# Altium project MiCore.PrjPCB
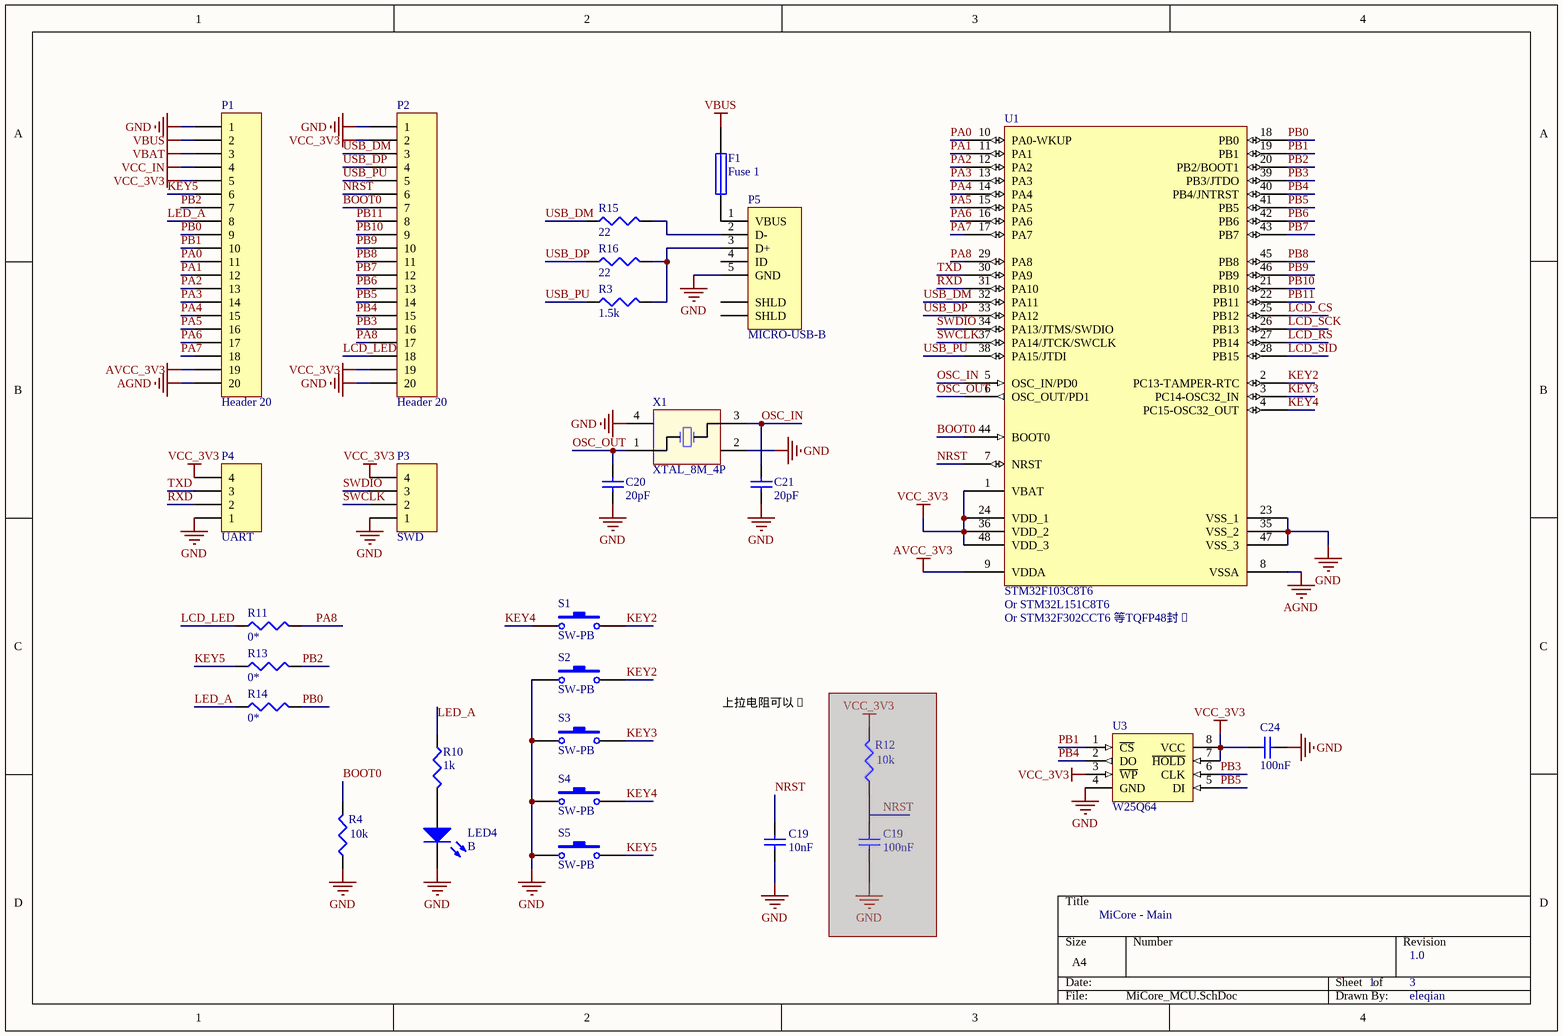
[diagram p0: MiCore_MCU.SchDoc]
3 sheets, 63 parts. Net scope: global (net labels, ports and power ports of the same name join across sheets).
Board file: MiCore.PcbDoc
Sheets:
  MiCore_MCU.SchDoc
  MiCore_PWR.SchDoc
  MiCore_LCD.SchDoc

## Sheet MiCore_MCU.SchDoc: MiCore - Main
size A4; DrawnBy: eleqian; Revision: 1.0; SheetNumber: 1; SheetTotal: 3

### Parts
(Parts that share a designator on the sheet are numbered #1, #2 ... from top to bottom, then left to right.)
C19#1  value 10nF  [0603C]  (hidden comment: Cap)
C19#2  value 100nF  [0603C]  (hidden comment: Cap)  (masked out: inside a compile mask, not in the netlist)
C20  value 20pF  [0603C]  (hidden comment: Cap)
C21  value 20pF  [0603C]  (hidden comment: Cap)
C24  value 100nF  [0603C]  (hidden comment: Cap)
F1  Fuse 1  [0805F]
LED4  B  [0603LED]
P1  Header 20  [HDR1X20]
P2  Header 20  [HDR1X20]
P3  SWD  [HDR1X4]
P4  UART  [HDR1X4]
P5  MICRO-USB-B  [MICRO-USB-B]
R3  value 1.5k  [0603R]  (hidden comment: Res3)
R4  value 10k  [0603R]  (hidden comment: Res3)
R10  value 1k  [0603R]  (hidden comment: Res3)
R11  value 0*  [0603R]  (hidden comment: Res3)
R12  value 10k  [0603R]  (hidden comment: Res3)  (masked out: inside a compile mask, not in the netlist)
R13  value 0*  [0603R]  (hidden comment: Res3)
R14  value 0*  [0603R]  (hidden comment: Res3)
R15  value 22  [0603R]  (hidden comment: Res3)
R16  value 22  [0603R]  (hidden comment: Res3)
S1  SW-PB  [SPST-SM2]
S2  SW-PB  [SPST-SM2]
S3  SW-PB  [SPST-SM2]
S4  SW-PB  [SPST-SM2]
S5  SW-PB  [SPST-SM2]
U1  STM32F103C8T6  [LQFP48]
U3  W25Q64  [SO8W]
X1  XTAL_8M_4P  [XTAL_5032_4P]

### Nets
AGND: P1.20 U1.8(VSSA)
AVCC_3V3: P1.19 U1.9(VDDA)
GND: C19#1.2 C20.2 C21.2 C24.2 LED4.2(K) P1.1 P2.1 P2.20 P3.1 P4.1 P5.5(GND) R4.1 S2.1 S3.1 S4.1 S5.1 U1.23(VSS_1) U1.35(VSS_2) U1.47(VSS_3) U3.4(GND) X1.2(OSC2) X1.4
VBAT: P1.3
VBUS: F1.2 P1.2
VCC_3V3: C24.1 P1.5 P2.2 P2.19 P3.4 P4.4 U1.1(VBAT) U1.24(VDD_1) U1.36(VDD_2) U1.48(VDD_3) U3.3(~{WP}) U3.7(~{HOLD}) U3.8(VCC)
VCC_IN: P1.4
BOOT0: P2.7 R4.2 U1.44(BOOT0)
KEY2: S1.2 S2.2 U1.2(PC13-TAMPER-RTC)
KEY3: S3.2 U1.3(PC14-OSC32_IN)
KEY4: S1.1 S4.2 U1.4(PC15-OSC32_OUT)
KEY5: P1.6 R13.1 S5.2
LCD_CS: U1.25(PB12)
LCD_LED: P2.18 R11.1
LCD_RS: U1.27(PB14)
LCD_SCK: U1.26(PB13)
LCD_SID: U1.28(PB15)
LED_A: P1.8 R10.1 R14.1
NRST: C19#1.1 P2.6 U1.7(NRST)
OSC_IN: C21.1 U1.5(OSC_IN/PD0) X1.3
OSC_OUT: C20.1 U1.6(OSC_OUT/PD1) X1.1(OSC1)
PA0: P1.11 U1.10(PA0-WKUP)
PA1: P1.12 U1.11(PA1)
PA2: P1.13 U1.12(PA2)
PA3: P1.14 U1.13(PA3)
PA4: P1.15 U1.14(PA4)
PA5: P1.16 U1.15(PA5)
PA6: P1.17 U1.16(PA6)
PA7: P1.18 U1.17(PA7)
PA8: P2.17 R11.2 U1.29(PA8)
PB0: P1.9 R14.2 U1.18(PB0)
PB1: P1.10 U1.19(PB1) U3.1(~{CS})
PB2: P1.7 R13.2 U1.20(PB2/BOOT1)
PB3: P2.16 U1.39(PB3/JTDO) U3.6(CLK)
PB4: P2.15 U1.40(PB4/JNTRST) U3.2(DO)
PB5: P2.14 U1.41(PB5) U3.5(DI)
PB6: P2.13 U1.42(PB6)
PB7: P2.12 U1.43(PB7)
PB8: P2.11 U1.45(PB8)
PB9: P2.10 U1.46(PB9)
PB10: P2.9 U1.21(PB10)
PB11: P2.8 U1.22(PB11)
RXD: P4.2 U1.31(PA10)
SWCLK: P3.2 U1.37(PA14/JTCK/SWCLK)
SWDIO: P3.3 U1.34(PA13/JTMS/SWDIO)
TXD: P4.3 U1.30(PA9)
USB_DM: P2.3 R15.1 U1.32(PA11)
USB_DP: P2.4 R16.1 U1.33(PA12)
USB_PU: P2.5 R3.1 U1.38(PA15/JTDI)
NetF1_1: F1.1 P5.1(VBUS)
NetLED4_1: LED4.1(A) R10.2
NetP5_2: P5.2(D-) R15.2
NetP5_3: P5.3(D+) R3.2 R16.2

Not connected (* = marked no-connect by the designer): P5 4(ID) 6(SHLD) 7(SHLD)

### Notes on the sheet
- (near U1) Or STM32L151C8T6
- (near U1) Or STM32F302CCT6 等TQFP48封�
- 上拉电阻可以�

### Library data of the parts
C19#1 C19#2 C20 C21 C24 = Cap: Capacitor; Published: 8-Jun-2000; LatestRevisionDate: 17-Jul-2002; LatestRevisionNote: Re-released for DXP Platform.; PackageReference: RAD-0.3; Publisher: Altium Limited; PackageDescription: Radial Cap, Thru-Hole; 2 Leads; 0.3 in Pin Spacing
F1 = Fuse 1: Fuse; Published: 8-Jun-2000; LatestRevisionDate: 17-Jul-2002; LatestRevisionNote: Re-released for DXP Platform.; PackageReference: PIN-W2/E2.8; Publisher: Altium Limited; PackageDescription: Thru-Hole; 2 Leads
LED4 = LED2: Typical Blue LED; Published: 8-Jun-2000; LatestRevisionDate: 17-Jul-2002; LatestRevisionNote: Re-released for DXP Platform.; PackageVersion: Feb-2002; PackageReference: 3.2X1.6X1.1; Publisher: Altium Limited
P1 P2 = Header 20: Header, 20-Pin; LatestRevisionDate: 17-Jul-2002; LatestRevisionNote: Re-released for DXP Platform.; Publisher: Altium Limited
P3 P4 = Header 4: Header, 4-Pin; LatestRevisionDate: 17-Jul-2002; LatestRevisionNote: Re-released for DXP Platform.; Publisher: Altium Limited
P5 = MICRO-USB-: MicroUSB母座
R3 R4 R10-R16 = Res3: Resistor; Published: 8-Jun-2000; LatestRevisionDate: 29-May-2009; LatestRevisionNote: IPC-7351 Footprint Added.; PackageReference: J1-0603; Publisher: Altium Limited; PackageDescription: Chip Resistor
S1-S5 = SW-PB: Switch; Published: 24-Mar-1999; LatestRevisionDate: 17-Jul-2002; LatestRevisionNote: Re-released for DXP Platform.; PackageReference: SPST-2; Publisher: Altium Limited
U1 = STM32F103C8T6: STM32 ARM-based 32-bit MCU with 64 Kbytes Flash, 48-pin LQFP, Industrial Temperature; Published: 30-May-2008; DatasheetVersion: rev6, Mar-2008; PackageVersion: Mar-2008; PackageReference: LQFP48; Publisher: Altium Limited; PackageDescription: 48-Pin Low-Profile Quad Flat Pack, 7 x 7 mm Body, 0.5 mm Pitch (LQFP48); ComponentLink1Description: Manufacturer Link; ComponentLink1URL: www.st.com/stm32; ComponentLink2Description: Datasheet; ComponentLink2URL: http://www.st.com/stonline/products/literature/ds/13587.pdf
U3 = W25Q64: SPI Flash
X1 = XTAL4P: 4脚贴片无源晶振

## Sheet MiCore_PWR.SchDoc: MiCore - Power
size A4; DrawnBy: eleqian; Revision: 1.0; SheetNumber: 2; SheetTotal: 3
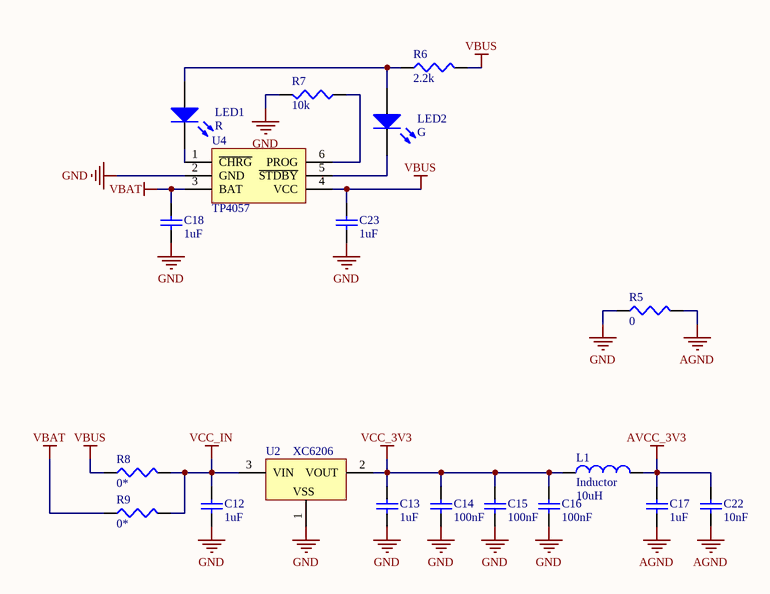
[diagram p1: MiCore_PWR.SchDoc]

### Parts
C12  value 1uF  [0603C]  (hidden comment: Cap)
C13  value 1uF  [0603C]  (hidden comment: Cap)
C14  value 100nF  [0603C]  (hidden comment: Cap)
C15  value 100nF  [0603C]  (hidden comment: Cap)
C16  value 100nF  [0603C]  (hidden comment: Cap)
C17  value 1uF  [0603C]  (hidden comment: Cap)
C18  value 1uF  [0603C]  (hidden comment: Cap)
C22  value 10nF  [0603C]  (hidden comment: Cap)
C23  value 1uF  [0603C]  (hidden comment: Cap)
L1  Inductor  value 10uH  [0805L]
LED1  R  [0603LED]
LED2  G  [0603LED]
R5  value 0  [0805R]  (hidden comment: Res3)
R6  value 2.2k  [0603R]  (hidden comment: Res3)
R7  value 10k  [0603R]  (hidden comment: Res3)
R8  value 0*  [0805R]  (hidden comment: Res3)
R9  value 0*  [0805R]  (hidden comment: Res3)
U2  XC6206  [SOT-23]
U4  TP4057  [SOT26A-6N]

### Nets
AGND: C17.2 C22.2 R5.2
AVCC_3V3: C17.1 C22.1 L1.2
GND: C12.2 C13.2 C14.2 C15.2 C16.2 C18.2 C23.1 R5.1 R7.2 U2.1(GND) U4.2(GND)
VBAT: C18.1 R9.1 U4.3(BAT)
VBUS: C23.2 R6.2 R8.1 U4.4(VCC)
VCC_3V3: C13.1 C14.1 C15.1 C16.1 L1.1 U2.2(VOUT)
VCC_IN: C12.1 R8.2 R9.2 U2.3(VIN)
NetLED1_1: LED1.1(A) LED2.1(A) R6.1
NetLED1_2: LED1.2(K) U4.1(~{CHRG})
NetLED2_2: LED2.2(K) U4.5(~{STDBY})
NetR7_1: R7.1 U4.6(PROG)

### Notes on the sheet
- (in symbol XC6206) VSS

### Library data of the parts
C12-C18 C22 C23 = Cap: Capacitor; Published: 8-Jun-2000; LatestRevisionDate: 17-Jul-2002; LatestRevisionNote: Re-released for DXP Platform.; PackageReference: RAD-0.3; Publisher: Altium Limited; PackageDescription: Radial Cap, Thru-Hole; 2 Leads; 0.3 in Pin Spacing
L1 = Inductor: Code_IEC: 1005; Published: 8-Jun-2000; LatestRevisionDate: 29-May-2009; LatestRevisionNote: IPC-7351 Footprint Added.; PackageReference: 0402-A; Publisher: Altium Limited; PackageDescription: Chip Inductor; Code_JEITA: 0402
LED1 = LED2: Typical RED LED; Published: 8-Jun-2000; LatestRevisionDate: 17-Jul-2002; LatestRevisionNote: Re-released for DXP Platform.; PackageVersion: Feb-2002; PackageReference: 3.2X1.6X1.1; Publisher: Altium Limited
LED2 = LED2: Typical GREEN LED; Published: 8-Jun-2000; LatestRevisionDate: 17-Jul-2002; LatestRevisionNote: Re-released for DXP Platform.; PackageVersion: Feb-2002; PackageReference: 3.2X1.6X1.1; Publisher: Altium Limited
R5-R9 = Res3: Resistor; Published: 8-Jun-2000; LatestRevisionDate: 29-May-2009; LatestRevisionNote: IPC-7351 Footprint Added.; PackageReference: J1-0603; Publisher: Altium Limited; PackageDescription: Chip Resistor
U2 = XC6206: LDO-3.3V
U4 = TP: 锂电池充电IC

## Sheet MiCore_LCD.SchDoc: MiCore - LCD
size A4; DrawnBy: eleqian; Revision: 1.0; SheetNumber: 3; SheetTotal: 3
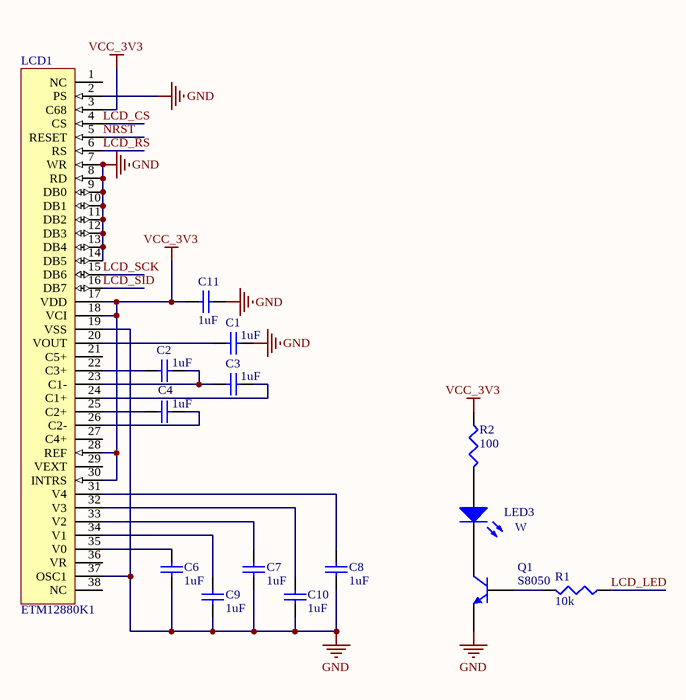
[diagram p2: MiCore_LCD.SchDoc]

### Parts
C1  value 1uF  [0603C]  (hidden comment: Cap)
C2  value 1uF  [0603C]  (hidden comment: Cap)
C3  value 1uF  [0603C]  (hidden comment: Cap)
C4  value 1uF  [0603C]  (hidden comment: Cap)
C6  value 1uF  [0603C]  (hidden comment: Cap)
C7  value 1uF  [0603C]  (hidden comment: Cap)
C8  value 1uF  [0603C]  (hidden comment: Cap)
C9  value 1uF  [0603C]  (hidden comment: Cap)
C10  value 1uF  [0603C]  (hidden comment: Cap)
C11  value 1uF  [0603C]  (hidden comment: Cap)
LCD1  ETM12880K1  [TL0350_38P]
LED3  W  [1206LED]
Q1  S8050  [SOT-23]
R1  value 10k  [0603R]  (hidden comment: Res3)
R2  value 100  [0603R]  (hidden comment: Res3)

### Nets
GND: C1.2 C6.1 C7.1 C8.1 C9.1 C10.1 C11.2 LCD1.2(PS) LCD1.7(WR) LCD1.8(RD) LCD1.9(DB0) LCD1.10(DB1) LCD1.11(DB2) LCD1.12(DB3) LCD1.13(DB4) LCD1.14(DB5) LCD1.19(VSS) LCD1.37(OSC1) Q1.3(E)
VCC_3V3: C11.1 LCD1.3(C68) LCD1.17(VDD) LCD1.18(VCI) LCD1.28(REF) LCD1.30(INTRS) R2.1
LCD_CS: LCD1.4(CS)
LCD_LED: R1.1
LCD_RS: LCD1.6(RS)
LCD_SCK: LCD1.15(DB6)
LCD_SID: LCD1.16(DB7)
NRST: LCD1.5(RESET)
NetC1_1: C1.1 LCD1.20(VOUT)
NetC2_1: C2.1 LCD1.22(C3+)
NetC2_2: C2.2 C3.1 LCD1.23(C1-)
NetC3_2: C3.2 LCD1.24(C1+)
NetC4_1: C4.1 LCD1.26(C2-)
NetC4_2: C4.2 LCD1.25(C2+)
NetC6_2: C6.2 LCD1.35(V0)
NetC7_2: C7.2 LCD1.33(V2)
NetC8_2: C8.2 LCD1.31(V4)
NetC9_2: C9.2 LCD1.34(V1)
NetC10_2: C10.2 LCD1.32(V3)
NetLED3_1: LED3.1(A) R2.2
NetLED3_2: LED3.2(K) Q1.1(C)
NetQ1_2: Q1.2(B) R1.2

Not connected (* = marked no-connect by the designer): LCD1 1(NC) 21(C5+) 27(C4+) 29(VEXT) 36(VR) 38(NC)

### Library data of the parts
C1-C4 C6-C11 = Cap: Capacitor; Published: 8-Jun-2000; LatestRevisionDate: 17-Jul-2002; LatestRevisionNote: Re-released for DXP Platform.; PackageReference: CAPC2012L; Publisher: Altium Limited
LCD1 = ETM12880K: LCD, 主控TL0350
LED3 = LED3: Typical White LED; Published: 8-Jun-2000; LatestRevisionDate: 17-Dec-2003; LatestRevisionNote: PCB Footprint replaced.; DatasheetVersion: 16-Apr-2002; PackageVersion: 16-Apr-2002; PackageReference: 3.5X2.8X1.9; Publisher: Altium Limited
Q1 = NPN: NPN Bipolar Transistor; pin to pad: 1>3 2>1 3>2; Published: 8-Jun-2000; LatestRevisionDate: 17-Jul-2002; LatestRevisionNote: Re-released for DXP Platform.; PackageReference: TO-226-AA; Publisher: Altium Limited; PackageDescription: TO, Flat Index; 3 In-Line, Axial Leads; Body Dia. 4.8mm; Leads 0.55 x 0.51 mm (max); Code_JEDEC: TO-226-AA
R1 R2 = Res3: Resistor; Published: 8-Jun-2000; LatestRevisionDate: 29-May-2009; LatestRevisionNote: IPC-7351 Footprint Added.; PackageReference: J1-0603; Publisher: Altium Limited; PackageDescription: Chip Resistor

## Nets that join several sheets
AGND: MiCore_MCU (P1.20 U1.8), MiCore_PWR (C17.2 C22.2 R5.2)
AVCC_3V3: MiCore_MCU (P1.19 U1.9), MiCore_PWR (C17.1 C22.1 L1.2)
GND: MiCore_MCU (22 pins), MiCore_PWR (11 pins), MiCore_LCD (19 pins)
VBAT: MiCore_MCU (P1.3), MiCore_PWR (C18.1 R9.1 U4.3)
VBUS: MiCore_MCU (F1.2 P1.2), MiCore_PWR (C23.2 R6.2 R8.1 U4.4)
VCC_3V3: MiCore_MCU (13 pins), MiCore_PWR (6 pins), MiCore_LCD (7 pins)
VCC_IN: MiCore_MCU (P1.4), MiCore_PWR (C12.1 R8.2 R9.2 U2.3)
LCD_CS: MiCore_MCU (U1.25), MiCore_LCD (LCD1.4)
LCD_LED: MiCore_MCU (P2.18 R11.1), MiCore_LCD (R1.1)
LCD_RS: MiCore_MCU (U1.27), MiCore_LCD (LCD1.6)
LCD_SCK: MiCore_MCU (U1.26), MiCore_LCD (LCD1.15)
LCD_SID: MiCore_MCU (U1.28), MiCore_LCD (LCD1.16)
NRST: MiCore_MCU (C19#1.1 P2.6 U1.7), MiCore_LCD (LCD1.5)